# EAGLE design omca (EAGLE 6.2)
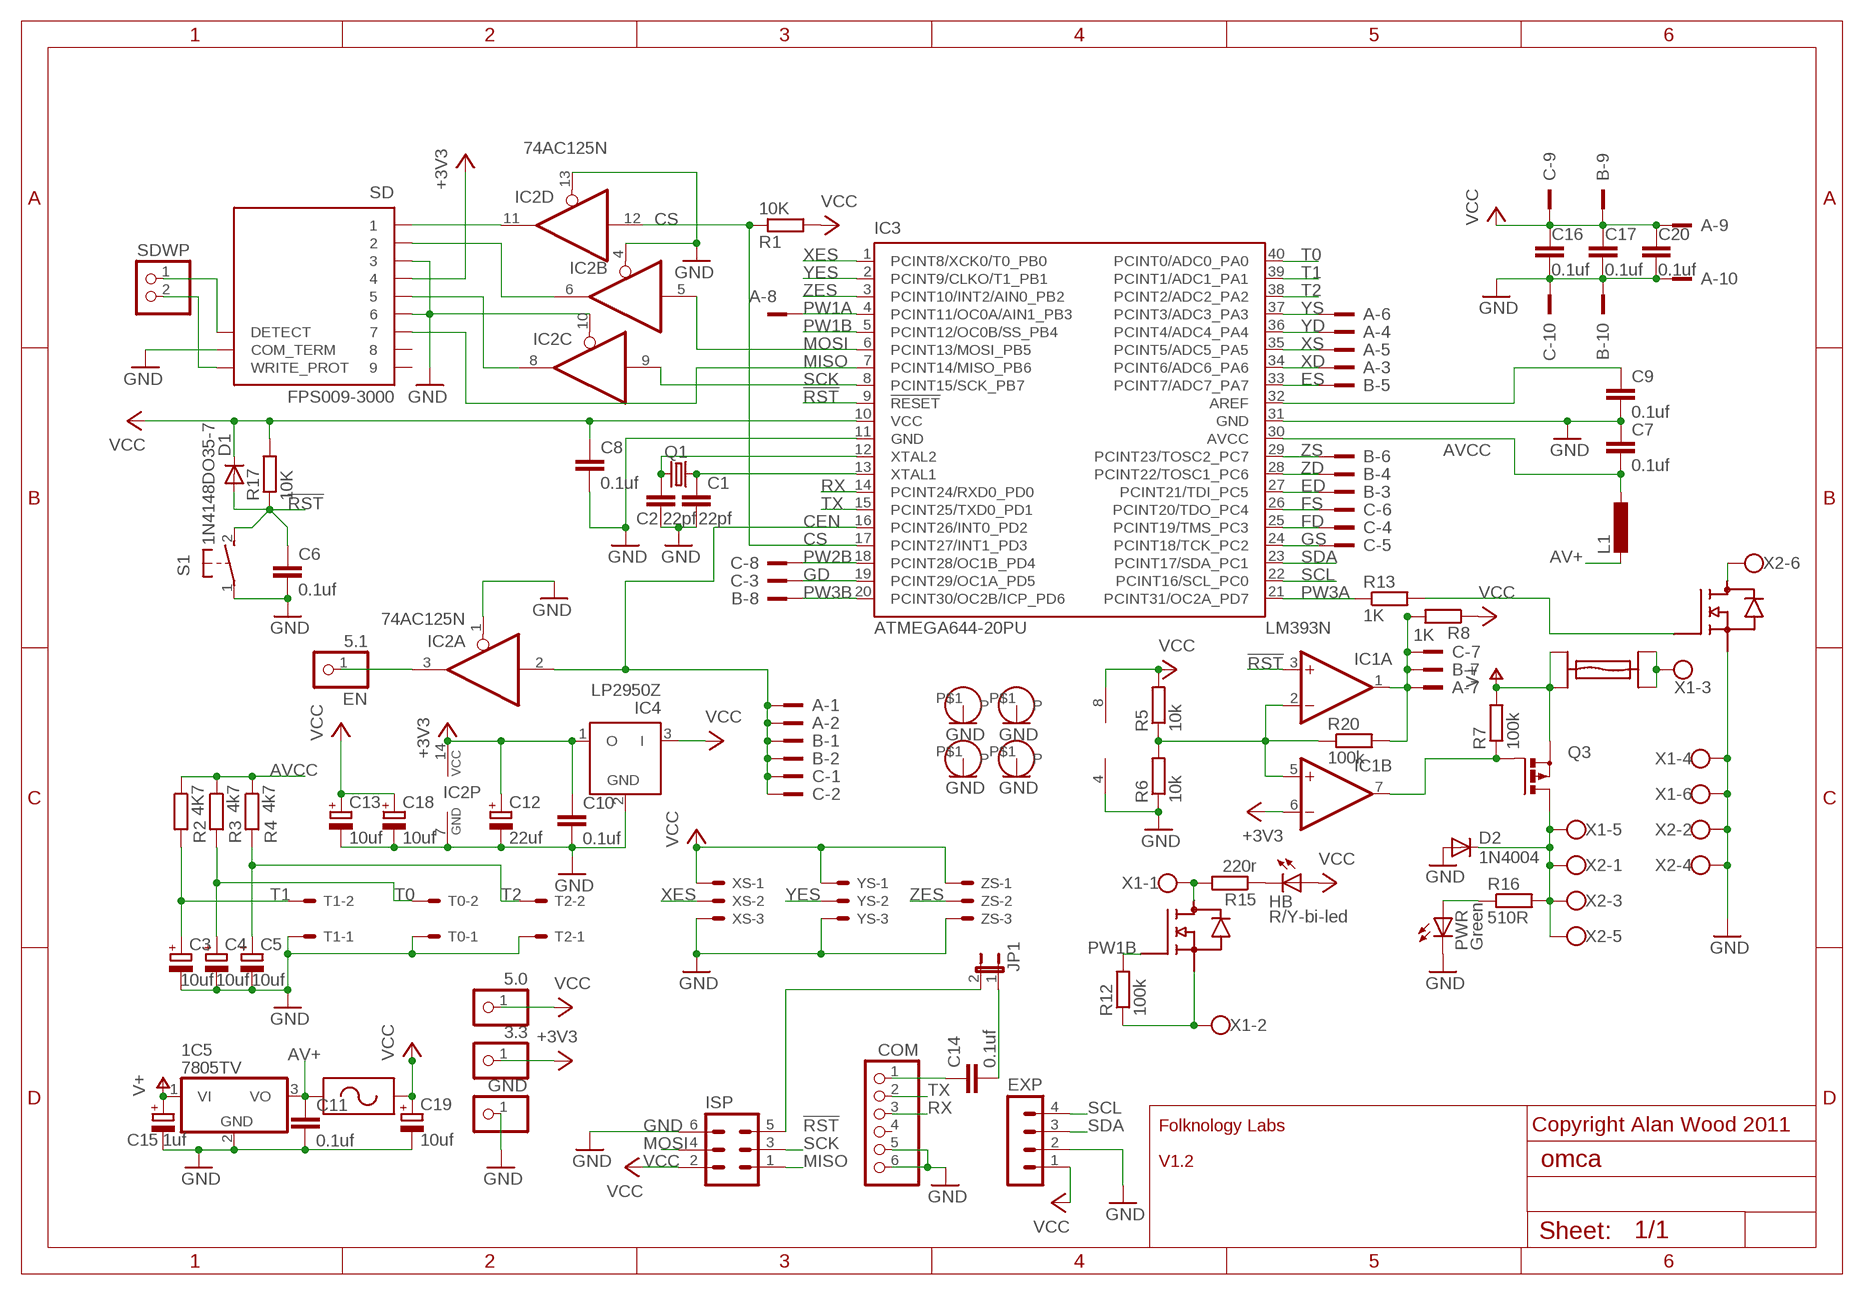
[diagram p0: schematic, sheet 1]

## Parts
1C5  7805TV  [TO220V]
3.3  PINHD-1X1  [1X01]
5.0  PINHD-1X1  [1X01]
5.1  EN  PINHD-1X1  [1X01]
A  2510-5  [PAK100/2500-5-10]
B  2510-5  [PAK100/2500-5-10]
C  2510-5  [PAK100/2500-5-10]
C1  22pf  C-EU025-024X044  [C025-024X044]
C2  22pf  C-EU025-024X044  [C025-024X044]
C3  10uf  CPOL-EUTT2D4  [TT2D4]
C4  10uf  CPOL-EUTT2D4  [TT2D4]
C5  10uf  CPOL-EUTT2D4  [TT2D4]
C6  0.1uf  C-EU025-024X044  [C025-024X044]
C7  0.1uf  C-EU025-024X044  [C025-024X044]
C8  0.1uf  C-EU025-024X044  [C025-024X044]
C9  0.1uf  C-EU025-024X044  [C025-024X044]
C10  0.1uf  C-EU025-024X044  [C025-024X044]
C11  0.1uf  C-EU025-024X044  [C025-024X044]
C12  22uf  CPOL-EUTT2D5  [TT2D5]
C13  10uf  CPOL-EUE2,5-6E  [E2,5-6E]
C14  0.1uf  C-EU025-024X044  [C025-024X044]
C15  1uf  CPOL-EUE2-4  [E2-4]
C16  0.1uf  C-EU025-024X044  [C025-024X044]
C17  0.1uf  C-EU025-024X044  [C025-024X044]
C18  10uf  CPOL-EUE2,5-6E  [E2,5-6E]
C19  10uf  CPOL-EUE2,5-6E  [E2,5-6E]
C20  0.1uf  C-EU025-024X044  [C025-024X044]
COM  PINHD-1X6/90  [1X06/90]
D1  1N4148DO35-7  [DO35-7]
D2  1N4004  [DO41-10]
EXP  MA04-1  [MA04-1]
F1  MINIBLADEFUSEHOLDER  [MINIFUSEHOLDER]
F2  RXEFXXX-RAYCHEM-POLYSWITCH  [2*5.1]
GND  PINHD-1X1  [1X01]
HB  R/Y-bi-led  LED3MM  [LED3MM]
IC1  LM393N  [DIL08]
IC2  74AC125N  [DIL14]
IC3  ATMEGA644-20PU  [DIL40]
IC4  LP2950Z  [TO92]
ISP  ML6  [ML6]
JP1  JP1E  [JP1]
L1  L-EU0207/10  [0207/10]
PWR  Green  LED3MM  [LED3MM]
Q1  CRYSTALHC49S  [HC49/S]
Q2  IPI80N03S4L-04TO262  [TO262]
Q3  PMOSFET_PTO220BV  [TO220BV]
Q4  NTD4963N  [IPAK]
R1  10K  R-EU_0204/7  [0204/7]
R2  4K7  R-EU_0204/7  [0204/7]
R3  4k7  R-EU_0204/7  [0204/7]
R4  4k7  R-EU_0204/7  [0204/7]
R5  10k  R-EU_0204/7  [0204/7]
R6  10k  R-EU_0204/7  [0204/7]
R7  100k  R-EU_0204/7  [0204/7]
R8  1K  R-EU_0204/7  [0204/7]
R12  100k  R-EU_0204/7  [0204/7]
R13  1K  R-EU_0204/7  [0204/7]
R15  220r  R-EU_0204/7  [0204/7]
R16  510R  R-EU_0204/7  [0204/7]
R17  10K  R-EU_0204/7  [0204/7]
R20  100k  R-EU_0204/7  [0204/7]
S1  31-XX  [B3F-31XX]
SD  FPS009-3000  [FPS009-3000]
SDWP  PINHD-1X2  [1X02]
T0  22-05-7028-02  [7395-02]
T1  22-05-7028-02  [7395-02]
T2  22-05-7028-02  [7395-02]
U$2  HOLE  [HOLE]
U$3  HOLE  [HOLE]
U$4  HOLE  [HOLE]
U$5  HOLE  [HOLE]
X1  W237-6  [W237-6]
X2  W237-6  [W237-6]
XS  22-05-7038-03  [7395-03]
YS  22-05-7038-03  [7395-03]
ZS  22-05-7038-03  [7395-03]

## Nets
!RST: C6.1 D1.A IC1.3(A:+IN) IC3.9(!RESET) ISP.5 JP1.2 R17.1 S1.2(S)
!SRST: A.7 B.7 C.7 IC1.1(A:OUT) R8.2 R20.2
+3V3: 3.3.1 C10.1 C12.+ IC1.6(B:-IN) IC2.14(P:VCC) IC4.1(O) SD.4
AV+: 1C5.3(VO) C11.1 F2.P$1 L1.2
AVCC: C7.2 IC3.30(AVCC) L1.1 R2.1 R3.1 R4.1
CEN: A.1 A.2 B.1 B.2 C.1 C.2 IC2.2(A:I) IC3.16(PCINT26/INT0_PD2)
CS: IC2.12(D:I) IC3.17(PCINT27/INT1_PD3) R1.1
ED: B.3 IC3.27(PCINT21/TDI_PC5)
ES: B.5 IC3.33(PCINT7/ADC7_PA7)
FD: C.4 IC3.25(PCINT19/TMS_PC3)
FS: C.6 IC3.26(PCINT20/TDO_PC4)
GD: C.3 IC3.19(PCINT29/OC1A_PD5)
GND: 1C5.2(GND) A.10 B.10 C1.2 C2.2 C3.- C4.- C5.- C6.2 C7.1 C8.2 C9.2 C10.2 C11.2 C12.- C13.- C15.- C16.2 C17.2 C18.- C19.- C20.2 C.10 COM.5 COM.6 D2.A EXP.2 GND.1 IC1.4(P:V-) IC2.1(A:OE) IC2.4(B:OE) IC2.7(P:GND) IC2.10(C:OE) IC2.13(D:OE) IC3.11(GND) IC3.31(GND) IC4.2(GND) ISP.6 PWR.K(C) Q4.P$3(S) R6.1 S1.1(P) SD.3 SD.6 SD.COM_TERM T0.1 T1.1 T2.1 U$2.P$1(P) U$3.P$1(P) U$4.P$1(P) U$5.P$1(P) X1.4 X1.6 X2.2 X2.4 XS.3 YS.3 ZS.3
GS: C.5 IC3.24(PCINT18/TCK_PC2)
MISO: IC3.7(PCINT14/MISO_PB6) ISP.1 SD.7
MOSI: IC2.5(B:I) IC3.6(PCINT13/MOSI_PB5) ISP.4
N$1: IC2.11(D:O) SD.1
N$2: IC2.6(B:O) SD.2
N$3: IC2.8(C:O) SD.5
N$4: HB.K(C) R15.1
N$5: C14.1 COM.1
N$6: SD.WRITE_PROT SDWP.2
N$7: 5.1.1 IC2.3(A:O)
N$9: Q2.2(D) R15.2 X1.1
N$10: Q2.3(S) R12.1 X1.2
N$11: Q4.P$2(D) X2.6
N$12: IC1.2(A:-IN) IC1.5(B:+IN) R5.1 R6.2 R20.1
N$13: SD.DETECT SDWP.1
N$14: IC1.7(B:OUT) Q3.G R7.1
N$15: Q4.P$1(G) R13.2
N$16: D2.C Q3.D R16.2 X1.5 X2.1 X2.3 X2.5
N$17: PWR.A R16.1
N$23: F1.P$1(F1A) F1.P$2(F1B) X1.3
N$32: C14.2 JP1.1
N$37: C2.1 IC3.12(XTAL2) Q1.2
N$38: C1.1 IC3.13(XTAL1) Q1.1
N$47: C9.1 IC3.32(AREF)
PW1A: A.8 IC3.4(PCINT11/OC0A/AIN1_PB3)
PW1B: IC3.5(PCINT12/OC0B/SS_PB4) Q2.1(G) R12.2
PW2B: C.8 IC3.18(PCINT28/OC1B_PD4)
PW3A: IC3.21(PCINT31/OC2A_PD7) R13.1
PW3B: B.8 IC3.20(PCINT30/OC2B/ICP_PD6)
RX: COM.3 IC3.14(PCINT24/RXD0_PD0)
SCK: IC2.9(C:I) IC3.8(PCINT15/SCK_PB7) ISP.3
SCL: EXP.4 IC3.22(PCINT16/SCL_PC0)
SDA: EXP.3 IC3.23(PCINT17/SDA_PC1)
T0: C4.+ IC3.40(PCINT0/ADC0_PA0) R3.2 T0.2
T1: C3.+ IC3.39(PCINT1/ADC1_PA1) R2.2 T1.2
T2: C5.+ IC3.38(PCINT2/ADC2_PA2) R4.2 T2.2
TX: COM.2 IC3.15(PCINT25/TXD0_PD1)
V+: 1C5.1(VI) C15.+ F1.P$3(F2A) F1.P$4(F2B) Q3.S R7.2
VCC: 5.0.1 A.9 B.9 C8.1 C13.+ C16.1 C17.1 C18.+ C19.+ C20.1 C.9 D1.C EXP.1 F2.P$2 HB.A IC1.8(P:V+) IC3.10(VCC) IC4.3(I) ISP.2 R1.2 R5.2 R8.1 R17.2 XS.1 YS.1 ZS.1
XD: A.3 IC3.34(PCINT6/ADC6_PA6)
XES: IC3.1(PCINT8/XCK0/T0_PB0) XS.2
XS: A.5 IC3.35(PCINT5/ADC5_PA5)
YD: A.4 IC3.36(PCINT4/ADC4_PA4)
YES: IC3.2(PCINT9/CLKO/T1_PB1) YS.2
YS: A.6 IC3.37(PCINT3/ADC3_PA3)
ZD: B.4 IC3.28(PCINT22/TOSC1_PC6)
ZES: IC3.3(PCINT10/INT2/AIN0_PB2) ZS.2
ZS: B.6 IC3.29(PCINT23/TOSC2_PC7)
Unconnected: COM.4 SD.8 SD.9

## Notes on the sheet
- Folknology Labs | Copyright Alan Wood 2011
- V1.2

## Library data of the parts
1C5 = linear:78*: Positive VOLTAGE REGULATOR Source: http://cache.national.com/ds/LM/LM78L05.pdf http://www.fairchildsemi.com/ds/LM/LM7805.pdf; MF: STMICROELECTRONICS; MPN: L7805CV; OC_FARNELL: 9756078
3.3 5.0 5.1 GND = pinhead:PINHD-1X1: PIN HEADER; MF: MULTICOMP; MPN: 2211S-02G; OC_FARNELL: 1593411
A B C = con-3m:2510-: 3M (TM) Pak 100 4-Wall Header Source: 3M; MF: HARTING; MPN: 09 18 510 7323; OC_FARNELL: 1096980; OC_NEWARK: unknown
C1 C2 = rcl:C-EU: CAPACITOR, European symbol; MF: AVX; MPN: SR151A220JAR; OC_FARNELL: 1100369
C3-C5 C12 C15 C18 C19 = rcl:CPOL-EU: POLARIZED CAPACITOR, European symbol; MF: RUBYCON; MPN: 100YXF10MEFC6.3X11; OC_FARNELL: 1144640
C6-C11 C14 C16 C17 C20 = rcl:C-EU: CAPACITOR, European symbol; MF: VISHAY; MPN: K104K15X7RF53L2; OC_FARNELL: 1141775
C13 = rcl:CPOL-EU: POLARIZED CAPACITOR, European symbol; MF: RUBYCON; MPN: 25ZL47MEFC5X11; OC_FARNELL: 1144696
COM = pinhead:PINHD-1X6: PIN HEADER; MF: MULTICOMP; MPN: MC34751; OC_FARNELL: 1593430
D1 = diode:1N4148: DIODE high speed (Philips); MF: VISHAY SEMICONDUCTOR; MPN: 1N4148-TR; OC_FARNELL: 1469384
D2 = diode:1N4004: DIODE general purpose rectifier, 1 A
EXP = con-lstb:MA04-1: PIN HEADER; MF: TE CONNECTIVITY / AMP; MPN: 826926-4; OC_FARNELL: 1248142; OC_NEWARK: unknown
F1 = gen:MINIBLADEFUSEHOLDER
F2 = gen:RXEFXXX-RAYCHEM-POLYSWITCH
HB PWR = led:LED: LED OSRAM: - CHIPLED LG R971, LG N971, LY N971, LG Q971, LY Q971, LO R971, LY R971 LH N974, LH R974 LS Q976, LO Q976, LY Q976 LO Q996 - Hyper CHIPLED LW Q18S LB Q993, LB Q99A, LB R99A - SideLED LS A670, LO A670, LY A670, LG A670, LP A670 LB A673, LV A673, LT A673, LW A673 LH A674 LY A675 LS A676, LA A676, LO A676, LY A676, LW A676 LS A679, LY A679, LG A679 - Hyper Micro SIDELED® LS Y876, LA Y876, LO Y876, LY Y876 LT Y87S - SmartLED LW L88C, LW L88S LB L89C, LB L89S, LG L890 LS L89K, LO L89K, LY L89K LS L896, LA L896, LO L896, LY L896 - TOPLED LS T670, LO T670, LY T670, LG T670, LP T670 LSG T670, LSP T670, LSY T670, LOP T670, LYG T670 LG T671, LOG T671, LSG T671 LB T673, LV T673, LT T673, LW T673 LH T674 LS T676, LA T676, LO T676, LY T676, LB T676, LH T676, LSB T676, LW T676 LB T67C, LV T67C, LT T67C, LS T67K, LO T67K, LY T67K, LW E67C LS E67B, LA E67B, LO E67B, LY E67B, LB E67C, LV E67C, LT E67C LW T67C LS T679, LY T679, LG T679 LS T770, LO T770, LY T770, LG T770, LP T770 LB T773, LV T773, LT T773, LW T773 LH T774 LS E675, LA E675, LY E675, LS T675 LS T776, LA T776, LO T776, LY T776, LB T776 LHGB T686 LT T68C, LB T68C - Hyper Mini TOPLED® LB M676 - Mini TOPLED Santana® LG M470 LS M47K, LO M47K, LY M47K Source: http://www.osram.convergy.de LUXEON: - LUMILED® LXK2-PW12-R00, LXK2-PW12-S00, LXK2-PW14-U00, LXK2-PW14-V00 LXK2-PM12-R00, LXK2-PM12-S00, LXK2-PM14-U00 LXK2-PE12-Q00, LXK2-PE12-R00, LXK2-PE12-S00, LXK2-PE14-T00, LXK2-PE14-U00 LXK2-PB12-K00, LXK2-PB12-L00, LXK2-PB12-M00, LXK2-PB14-N00, LXK2-PB14-P00, LXK2-PB14-Q00 LXK2-PR12-L00, LXK2-PR12-M00, LXK2-PR14-Q00, LXK2-PR14-R00 LXK2-PD12-Q00, LXK2-PD12-R00, LXK2-PD12-S00 LXK2-PH12-R00, LXK2-PH12-S00 LXK2-PL12-P00, LXK2-PL12-Q00, LXK2-PL12-R00 Source: www.luxeon.com KINGBRIGHT: KA-3528ASYC Source: www.kingbright.com
IC1 = linear:LM393: COMPARATOR; MF: ON SEMICONDUCTOR; MPN: LM393NG; OC_FARNELL: 1211133
IC2 = 74xx-eu:74*125: Quad bus BUFFER, 3-state; MF: TEXAS INSTRUMENTS; MPN: SN74AHC125N; OC_FARNELL: 1749617
IC3 = atmel:ATMEGA644-*PU: 8-bit Microcontroller with 64K Bytes In-System Programmable Flash Auto generated by make-symbol-device-package-bsdl.ulp Rev. 34 Source: http://www.atmel.com/dyn/resources/prod_documents/doc2593.pdf; MF: ATMEL; MPN: ATMEGA644-20PU; OC_FARNELL: 1288340; OC_NEWARK: 23M5060
IC4 = linear:LP2950: 100 mA, Low Power Low Dropout Voltage Regulator Source: http://www.onsemi.com/pub/Collateral/LP2950-D.PDF; MF: NATIONAL SEMICONDUCTOR; MPN: LP2950CZ-3.3/NOPB; OC_FARNELL: 1469118
ISP = con-harting-ml:ML6: HARTING; MF: HARTING; MPN: 09 18 506 7324; OC_FARNELL: 1096984; OC_NEWARK: unknown
JP1 = jumper:JP1E: JUMPER; MF: MULTICOMP; MPN: 2211S-02G; OC_FARNELL: 1593411
L1 = rcl:L-EU: INDUCTOR, European symbol; MF: MULTICOMP; MPN: MCAL0410A1-101KU; OC_FARNELL: 1864497
Q1 = crystal:CRYSTAL: CRYSTAL; MF: MULTICOMP; MPN: HC49SM-3.6864-30-50-60-16-ATF; OC_FARNELL: 1667008; OC_NEWARK: unknown
Q2 = amino:IPI80N03S4L-04
Q3 = transistor-power:PMOSFET_P: Power MOSFET P-Channel; MF: VISHAY; MPN: SUP75P03-07-E3; OC_FARNELL: 1794812
Q4 = amino:NTD4963N
R1 R5 R6 R17 = rcl:R-EU_: RESISTOR, European symbol; MF: WELWYN; MPN: MFR4 10K 1%; OC_FARNELL: 1099988
R2-R4 = rcl:R-EU_: RESISTOR, European symbol; MF: WELWYN; MPN: MFR4 4K7 1%; OC_FARNELL: 1099979
R7 R12 R20 = rcl:R-EU_: RESISTOR, European symbol; MF: WELWYN; MPN: MFR4 100K 1%; OC_FARNELL: 1100015
R8 R13 = rcl:R-EU_: RESISTOR, European symbol; MF: WELWYN; MPN: MFR4 1K 1%; OC_FARNELL: 1099893
R15 R16 = rcl:R-EU_: RESISTOR, European symbol; MF: WELWYN; MPN: MFR4 470R 1%; OC_FARNELL: 1099883
S1 = switch-omron:31-XX: OMRON SWITCH; MPN: B3F-3100; OC_FARNELL: 959704; OC_NEWARK: 36M3582
SD = con-yamaichi:FPS009-300*: SD Card and MMC Reader (Manual Insertion) Source: http://www.yamaichi.de/pdf/c_fps009_3000.pdf; MF: MULTICOMP; MPN: SDAMB-01215BT00; OC_FARNELL: 9186140; OC_NEWARK: unknown
SDWP = pinhead:PINHD-1X2: PIN HEADER; MF: MULTICOMP; MPN: 2211S-02G; OC_FARNELL: 1593411
T0 T1 T2 = con-molex:22-?-02: CONNECTOR wire to board 2.54 mm (.1 inch) pitch header; MF: MOLEX; MPN: 22-05-7028; OC_FARNELL: 9731601; OC_NEWARK: unknown
U$2-U$5 = amino:HOLE; OC_FARNELL: unknown
X1 X2 = con-wago-500:W237-6: WAGO SCREW CLAMP; OC_FARNELL: unknown; OC_NEWARK: unknown
XS YS ZS = con-molex:22-?-03: CONNECTOR wire to board 2.54 mm (.1 inch) pitch header; MF: MOLEX; MPN: 22-05-7038; OC_FARNELL: 9731610; OC_NEWARK: unknown

## Board
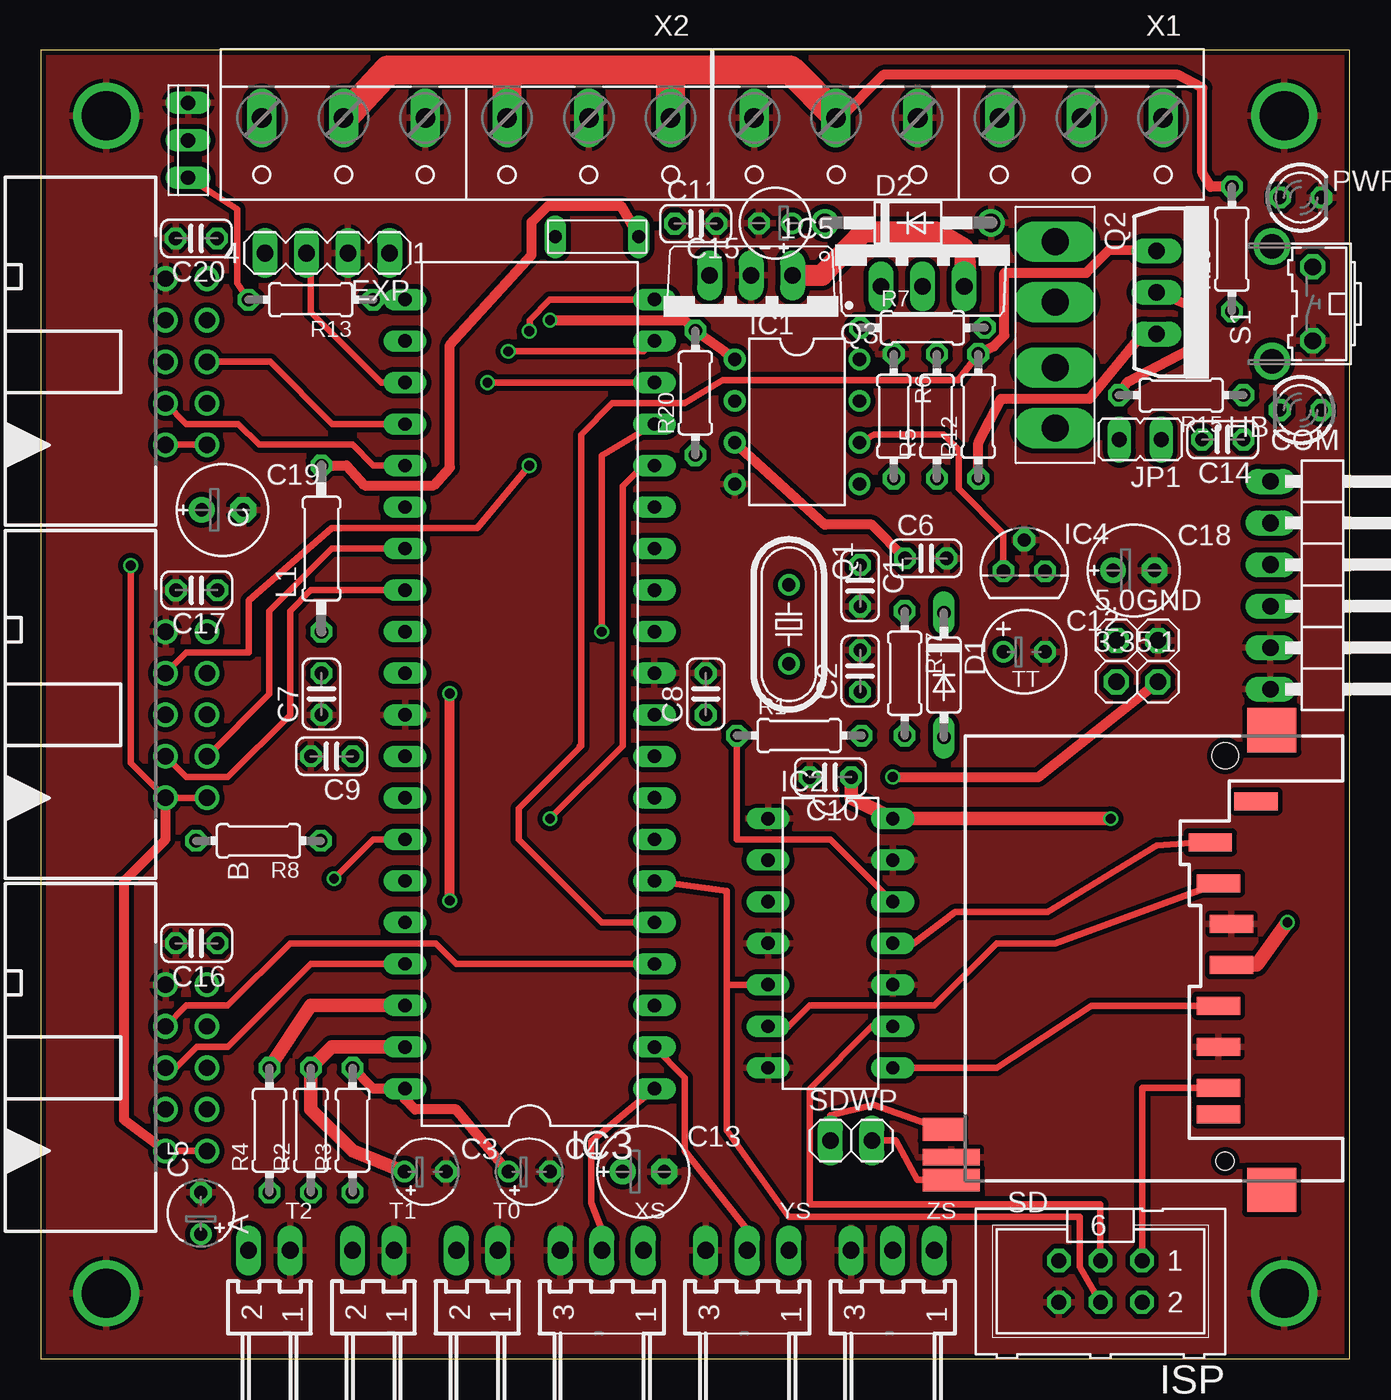
[diagram p1: board, top side]
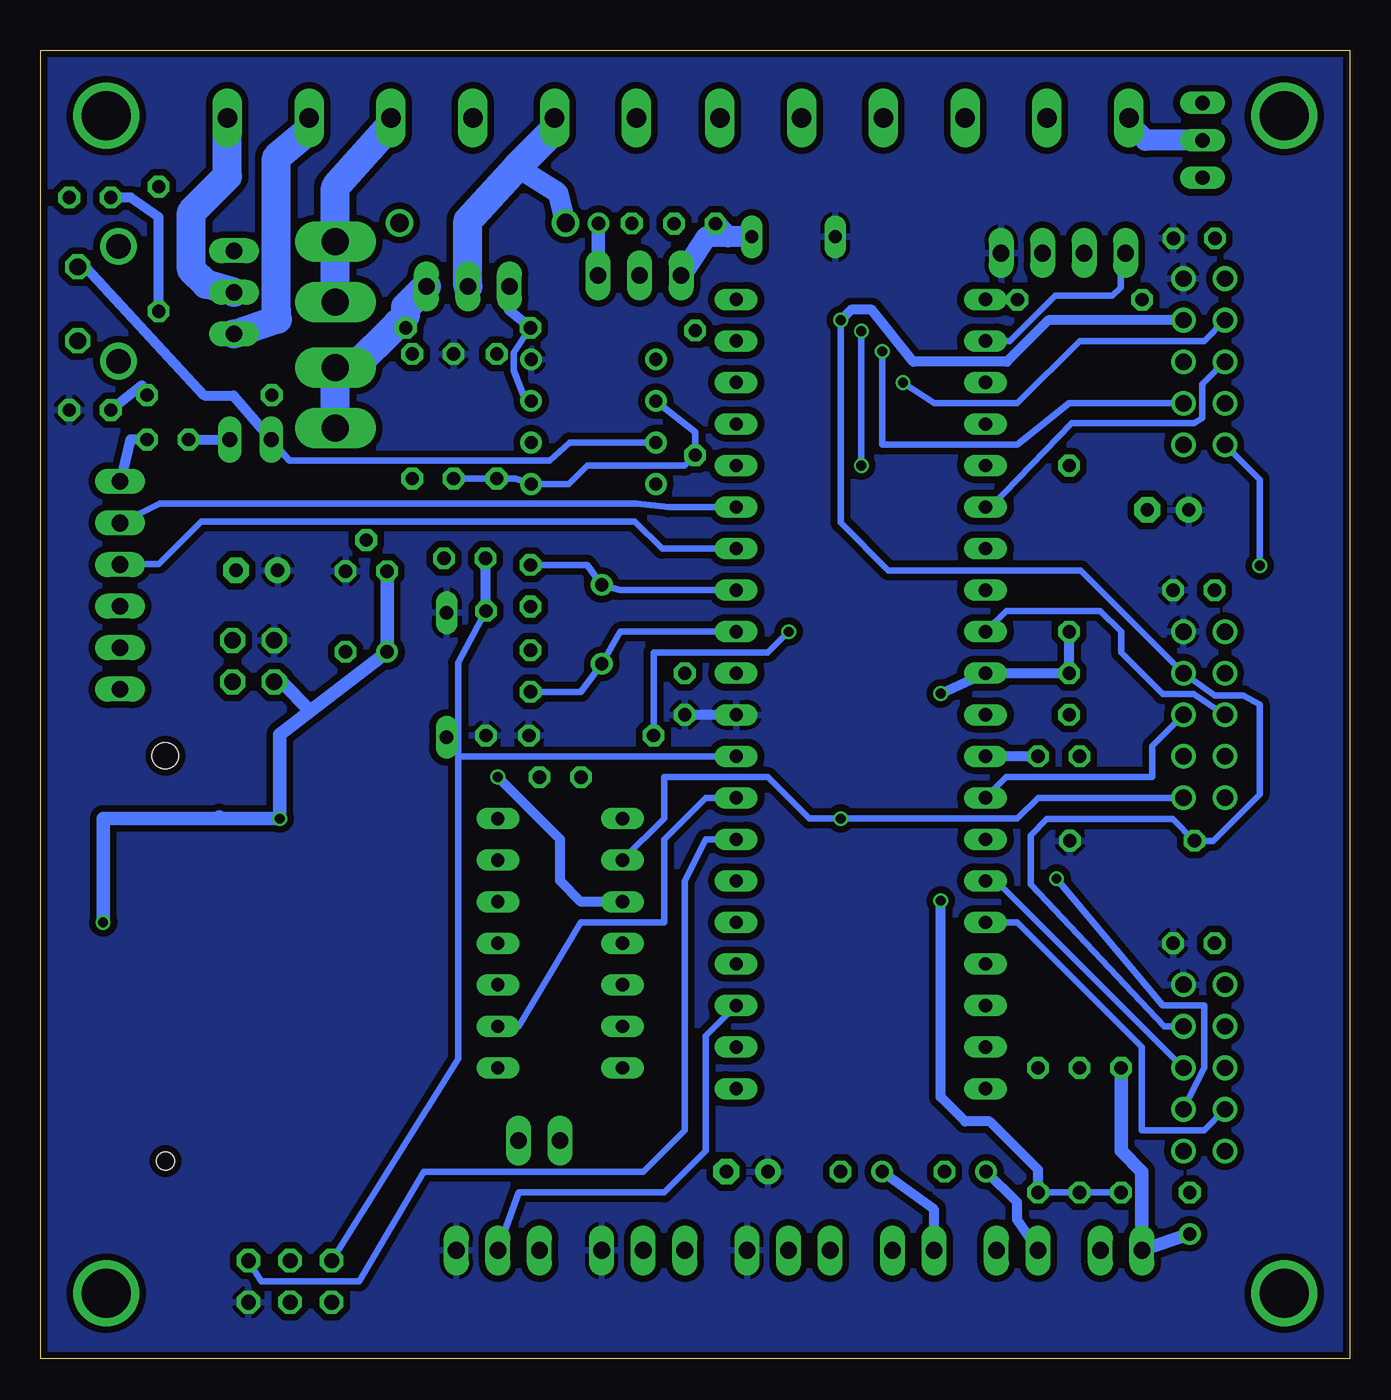
[diagram p2: board, bottom side, seen from below]

Size 80 x 80 mm. Coordinates in mm from the lower left corner, seen from the top.
Outline: 0,0 80,0 80,80 0,80 0,0
Copper layers (1*16): Top 0.035mm / dielectric 1.5mm / Bottom 0.035mm
Design rules: minimum track width 6mil, minimum drill 12mil, track to track 6mil, track to pad 6mil, pad to pad 6mil, via to via 6mil, smd to smd 0mil, copper to edge 10mil, drill to drill 10mil, minimum pad ring 10mil, minimum via ring 6mil, stop-mask expansion 2mil, vias tented up to drill 100mil, thermal gap 10mil

### Footprints (pad centres in the part's own frame; a part is rotated, then mirrored left to right if it is on the bottom)
TO220V = drill 1.016 long: 1 -2.54,-2.54; 2 0,-2.54; 3 2.54,-2.54
1X01 = drill 1.016 octagon: 1 0,0
PAK100/2500-5-10 = drill 1 pad 1.422: 1 -5.08,-1.27; 2 -5.08,1.27; 3 -2.54,-1.27; 4 -2.54,1.27; 5 0,-1.27; 6 0,1.27; 7 2.54,-1.27; 8 2.54,1.27; 9 5.08,-1.27; 10 5.08,1.27
C025-024X044 = drill 0.813 octagon: 1 -1.27,0; 2 1.27,0
TT2D4 = drill 0.813: + -1.27,0 | drill 0.813 octagon: - 1.27,0
TT2D5 = drill 0.813: + -1.27,0 | drill 0.813 octagon: - 1.27,0
E2,5-6E = drill 0.813 pad 1.575: + -1.27,0 | drill 0.813 pad 1.575 octagon: - 1.27,0
E2-4 = drill 0.813 pad 1.27: + -1.016,0 | drill 0.813 pad 1.27 octagon: - 1.016,0
1X06/90 = drill 1.016 long: 1 -6.35,-3.81; 2 -3.81,-3.81; 3 -1.27,-3.81; 4 1.27,-3.81; 5 3.81,-3.81; 6 6.35,-3.81
DO35-7 = drill 0.813 long: A 3.81,0; C -3.81,0
DO41-10 = drill 1.118: A 5.08,0; C -5.08,0
MA04-1 = drill 1.016 long: 1 -3.81,0; 2 -1.27,0; 3 1.27,0; 4 3.81,0
MINIFUSEHOLDER = drill 1.65 long: P$1 -5.7,0; P$2 -2,0; P$3 2,0; P$4 5.7,0
2*5.1 = drill 0.8 long: P$1 -2.55,0; P$2 2.55,0
LED3MM = drill 0.813 octagon: A -1.27,0; K 1.27,0
DIL08 = drill 0.813 pad 1.27: 1 -3.81,-3.81; 2 -1.27,-3.81; 3 1.27,-3.81; 4 3.81,-3.81; 5 3.81,3.81; 6 1.27,3.81; 7 -1.27,3.81; 8 -3.81,3.81
DIL14 = drill 0.813 long: 1 -7.62,-3.81; 2 -5.08,-3.81; 3 -2.54,-3.81; 4 0,-3.81; 5 2.54,-3.81; 6 5.08,-3.81; 7 7.62,-3.81; 8 7.62,3.81; 9 5.08,3.81; 10 2.54,3.81; 11 0,3.81; 12 -2.54,3.81; 13 -5.08,3.81; 14 -7.62,3.81
DIL40 = drill 0.813 long: 1 -24.13,-7.62; 2 -21.59,-7.62; 3 -19.05,-7.62; 4 -16.51,-7.62; 5 -13.97,-7.62; 6 -11.43,-7.62; 7 -8.89,-7.62; 8 -6.35,-7.62; 9 -3.81,-7.62; 10 -1.27,-7.62; 11 1.27,-7.62; 12 3.81,-7.62; 13 6.35,-7.62; 14 8.89,-7.62; 15 11.43,-7.62; 16 13.97,-7.62; 17 16.51,-7.62; 18 19.05,-7.62; 19 21.59,-7.62; 20 24.13,-7.62; 21 24.13,7.62; 22 21.59,7.62; 23 19.05,7.62; 24 16.51,7.62; 25 13.97,7.62; 26 11.43,7.62; 27 8.89,7.62; 28 6.35,7.62; 29 3.81,7.62; 30 1.27,7.62; 31 -1.27,7.62; 32 -3.81,7.62; 33 -6.35,7.62; 34 -8.89,7.62; 35 -11.43,7.62; 36 -13.97,7.62; 37 -16.51,7.62; 38 -19.05,7.62; 39 -21.59,7.62; 40 -24.13,7.62
TO92 = drill 0.813 octagon: 1 -1.27,0; 2 0,1.905; 3 1.27,0
ML6 = drill 0.914 octagon: 1 -2.54,-1.27; 2 -2.54,1.27; 3 0,-1.27; 4 0,1.27; 5 2.54,-1.27; 6 2.54,1.27
JP1 = drill 0.914 long: 1 0,-1.27; 2 0,1.27
0207/10 = drill 0.813 octagon: 1 -5.08,0; 2 5.08,0
HC49/S = drill 0.813: 1 -2.413,0; 2 2.413,0
TO262 = drill 1.016 long: 1 -2.54,0; 2 0,0; 3 2.54,0
TO220BV = drill 1.016 long: D 0,-2.54; G -2.54,-2.54; S 2.54,-2.54
IPAK = drill 0.88 pad 1.27 long: P$1 -2.29,0; P$2 0,0; P$3 2.29,0
0204/7 = drill 0.813 octagon: 1 -3.81,0; 2 3.81,0
B3F-31XX = drill 1.016 octagon: 1 -2.261,-1.245; 2 2.261,-1.245 | drill 1.499 pad 2.159: 3 -3.505,1.245; 4 3.505,1.245
FPS009-3000 = smd 2.65 x 1.1: 1 -0.915,-5.3; 2 -0.415,-7.8; 3 0.385,-10.3; 4 0.385,-12.8; 5 -0.415,-15.3; 6 -0.415,-17.8; 7 -0.415,-20.3; 8 -0.415,-21.925; 9 1.885,-2.8 | smd 3.5 x 1: COM_TERM -16.75,-24.55 | smd 2.5 x 1.4: DETECT -17.25,-22.85 | smd 3 x 2.7: M1 2.85,1.55; M2 2.85,-26.55 | smd 3.5 x 1.4: WRITE_PROT -16.75,-25.95 | hole 1.6: 0,0 | hole 1.1: 0,-24.8
1X02 = drill 1.016 long: 1 -1.27,0; 2 1.27,0
7395-02 = drill 1.016 long: 1 1.27,0; 2 -1.27,0
HOLE = drill 3: P$1 0,0
W237-6 = drill 1.194 long: 1 -12.5,-1.27; 2 -7.5,-1.27; 3 -2.5,-1.27; 4 2.5,-1.27; 5 7.5,-1.27; 6 12.5,-1.27
7395-03 = drill 1.016 long: 1 2.54,0; 2 0,0; 3 -2.54,0

### Placement (x,y rotation side)
1C5  43.41,63.7 180 top
3.3  65.74,41.38 0 top
5.0  65.74,43.92 0 top
5.1  68.28,41.38 0 top
A  8.89,17.78 90 top
B  8.89,39.37 90 top
C  8.89,60.96 90 top
C1  50.08,47.26 270 top
C2  50.08,42.05 90 top
C3  23.5,11.43 0 top
C4  29.84,11.43 0 top
C5  9.78,8.89 90 top
C6  54.09,48.94 0 top
C7  17.14,40.64 90 top
C8  40.64,40.64 90 top
C9  17.78,36.83 180 top
C10  48.26,35.56 180 top
C11  40.02,69.4 0 top
C12  60.11,43.22 0 top
C13  36.83,11.43 0 top
C14  72.25,56.2 180 top
C15  44.9,69.42 180 top
C16  9.53,25.4 180 top
C17  9.53,46.99 180 top
C18  66.8,48.2 0 top
C19  11.1,51.9 0 top
C20  9.5,68.5 180 top
COM  78.97,47.28 270 top
D1  55.2,41.8 270 top
D2  53,69.45 0 top
EXP  17.5,67.6 180 top
F1  62,62.6 270 top
F2  34,68.6 180 top
GND  68.28,43.92 0 top
HB  77,58 180 top
IC1  46.22,57.28 270 top
IC2  48.26,25.4 270 top
IC3  29.88,40.64 90 top
IC4  60.11,48.15 0 top
ISP  64.77,4.72 180 top
JP1  67.2,56.2 90 top
L1  17.14,49.53 90 top
PWR  77,71 0 top
Q1  45.72,44.9 270 top
Q2  68.2,65.2 270 top
Q3  53.9,68.11 0 top
Q4  9,74.5 90 top
R1  46.35,38.1 0 top
R2  16.51,13.97 90 top
R3  19.05,13.97 90 top
R4  13.97,13.97 90 top
R5  54.77,57.62 90 top
R6  52.13,57.62 270 top
R7  53.88,63.03 0 top
R8  13.29,31.66 180 top
R12  57.3,57.62 90 top
R13  16.5,64.75 180 top
R15  69.7,58.91 180 top
R16  72.8,67.85 90 top
R17  52.8,41.91 270 top
R20  40.01,59.05 90 top
S1  76.5,64.5 90 top
SD  72.39,36.87 0 top
SDWP  49.53,13.34 0 top
T0  26.67,6.62 0 top
T1  20.32,6.62 0 top
T2  13.97,6.62 0 top
U$2  4,4 0 top
U$3  4,76 0 top
U$4  76,76 0 top
U$5  76,4 0 top
X1  56.1,74.6 180 top
X2  26,74.6 180 top
XS  34.29,6.62 0 top
YS  43.18,6.62 0 top
ZS  52.07,6.62 0 top

### Tracks (layer width: path | path; a pad name or v marks a point on that pad's centre or on a via)
!RST
  Top 0.61: C6.1 50.8,51 47.92,51 IC1.3
  Bottom 0.406: 54.5,36.83 54.5,18.33 ISP.5 | 54.5,36.83 IC3.9 | R17.1 54.5,42.56 54.5,38 | 54.5,38 54.5,36.83 | D1.A 54.51,37.99 54.5,38 | JP1.2 64.83,54.9 48.9,54.9 47.69,56.02 IC1.3
  Bottom 0.61: C6.1 52.83,47.01 R17.1 | S1.2 77.25,66.75 70,58.9 68.23,58.9 JP1.2
!SRST  (via drill 0.6)
  Top 0.61: v31.11,63.5 39.37,63.5 R20.2 41.77,61.59 IC1.1
  Bottom 0.406: v31.11,63.5 31.11,51.12 28.2,48.2 16.45,48.2 B.7 8.25,40.55 6.5,40.55 5.5,40 5.5,34.5 8.34,31.66 R8.2 10.82,33 18.5,33 19.5,32 19.5,29 11.32,20.32 A.7
  Bottom 0.61: C.7 18.41,63.5 20.95,60.96 26.67,60.96 29.21,64.14 30.48,64.14 v31.11,63.5
+3V3  (via drill 0.6)
  Top 0.406: IC4.1 58.84,50.46 56.1,53.2 56.1,55.6 55.2,56.5 50.95,56.5 IC1.6
  Top 0.813: SD.4 74.33,24.07 v76.2,26.67 | v65.41,33.02 IC2.14 49.53,34.29 C10.1
  Bottom 0.813: v76.2,26.67 76.2,33.02 69,33.02 | 69,33.02 v65.41,33.02 65.41,38.16 63.52,39.61 | 69.11,33.13 69,33.02 | 63.52,39.61 C12.+ IC4.1 | 3.3.1 65.29,41.38 63.52,39.61
AV+
  Top 0.61: L1.2 18.69,54.61 19.8,53.4 24,53.4 25,54.5 25,62 30,67.5 30,69.5 31,70.5 35.45,70.5 F2.P$1
  Bottom 1.27: F2.P$1 38,68.6 | 38,68.6 39.31,68.6 1C5.3 | C11.1 38.26,68.86 38,68.6
AVCC  (via drill 0.6)
  Top 0.61: v25,28 v25,40.67
  Bottom 0.406: R4.1 R2.1 R3.1
  Bottom 0.61: L1.1 C7.2 IC3.30 v25,40.67 | R3.1 19.05,11.55 22,14.5 23.5,14.5 25,16 v25,28
CEN  (via drill 0.6)
  Top 0.406: v31.11,33.02 35.56,37.47 35.56,53.34 36.83,54.61 IC3.16 | A.2 A.1 | B.1 B.2 5.5,36.41 v5.5,48.5 | C.2 C.1
  Top 0.61: A.2 5.08,14.61 5.08,29.21 7.62,31.75 B.2
  Bottom 0.406: B.1 19.05,34.29 20.32,33.02 v31.11,33.02 33.02,33.02 35.56,35.56 41.91,35.56 41.91,33.02 IC2.2 | v5.5,48.5 5.5,53.76 C.2
CS  (via drill 0.6)
  Top 0.406: IC3.17 34.29,55.21 v34.29,44.45 | IC2.12 48.26,31.75 42.55,31.75 R1.1
  Bottom 0.406: v34.29,44.45 35.56,43.18 42.55,43.18 R1.1
ED
  Top 0.406: IC3.27 17.78,49.53 13.97,45.72 13.97,40.64 B.3
ES
  Bottom 0.406: IC3.33 20.99,35.56 12.06,35.56 12.06,37.47 B.5
FD
  Top 0.406: C.4 8.89,57.15 12.06,57.15 13.34,55.88 19.05,55.88 20.32,54.61 IC3.25
FS
  Bottom 0.406: C.6 9,59.58 9,57.5 9.5,57.2 17,57.2 21.93,52.07 IC3.26
GD  (via drill 0.6)
  Top 0.406: IC3.19 36.87,61.59 v28.57,61.59
  Bottom 0.406: v28.57,61.59 28.57,55.88 20.32,55.88 17.14,58.42 C.3
GND
  pour Top (isolate 0.305): 0,80 80,80 80,0 0,0
GS
  Top 0.406: C.5 14.01,60.96 17.82,57.15 IC3.24
MISO
  Top 0.406: ISP.1 67.33,16.57 SD.7
  Bottom 0.406: ISP.1 66.54,4.72 60.55,4.72 56.61,11.43 43.18,11.43 40.64,13.97 40.64,29.21 39.37,31.75 IC3.7
MOSI
  Top 0.406: ISP.4 63.5,5.62 63.5,8.66 45.72,8.66 41.91,13.97 41.91,22.86 | 41.91,22.86 IC2.5 | IC3.6 41.91,28.61 41.91,22.86
N$1
  Top 0.406: SD.1 70.72,31.57 68.22,31.39 61.53,27.3 55.88,27.3 53.34,25.4 IC2.11
N$2
  Top 0.406: SD.2 61.99,25.4 58.42,25.4 54.61,21.59 46.99,21.59 45.72,20.32 IC2.6
N$3
  Top 0.406: IC2.8 58.42,17.78 64.21,21.57 SD.5
N$4
  Bottom 0.61: R15.1 73.83,59.5 HB.K
N$5
  Bottom 0.61: C14.1 74.53,56.2 COM.1
N$6
  Top 0.406: SD.WRITE_PROT 53.55,10.92 52.24,13.34 SDWP.2
N$7  (via drill 0.6)
  Top 0.61: v52.07,35.56 60.96,35.56 5.1.1
  Bottom 0.61: v52.07,35.56 48.26,31.75 48.26,29.21 46.99,27.94 IC2.3
N$9
  Top 0.61: R15.2 66.42,59.72 70.2,61.7 70.2,64.4 Q2.2
  Bottom 1.778: Q2.2 69.9,65.7 70.8,66.6 70.8,70.1 68.6,72.3 X1.1
N$10
  Top 0.61: R12.1 57.3,56 58.7,58.7 64.1,58.7 67.3,62.6 Q2.3
  Bottom 1.778: Q2.3 65.54,63.56 65.6,64.1 65.6,73.43 63.6,75.13 X1.2
N$11
  Bottom 1.27: Q4.P$2 12.47,74.5 13.5,75.53 X2.6
N$12
  Bottom 0.406: R5.1 R6.2 50.99,53.81 IC1.5 47.73,53.48 46.6,54.6 40.65,54.6 R20.1 40.01,56.65 IC1.2
N$13
  Top 0.406: SD.DETECT 50.91,15.52 48.26,14.88 SDWP.1
N$14
  Bottom 0.406: IC1.7 50.35,58.55 51.1,60.4 51.1,61.51 R7.1
  Bottom 0.61: R7.1 51.4,64.1 Q3.G
N$15
  Top 0.406: Q4.P$1 12,70.29 12,65.75 R13.2
N$16
  Top 0.61: R16.2 71.5,71.66 71,72.5 71,77.7 69.5,78.5 51.49,78.5 48.76,75.77 X1.5
  Top 1.778: X2.5 21.23,78.8 28.5,78.8 | 28.5,78.8 38.5,78.8 | 38.5,78.8 45.8,78.8 48.6,76 X1.5 | X2.3 28.5,78.8 | X2.1 38.5,78.8
  Bottom 1.27: D2.C 48.38,71.25 50.9,72.87
  Bottom 1.778: Q3.D 53.9,69.59 50.9,72.87 48.6,75.17 X1.5
N$17
  Bottom 0.61: R16.1 72.8,69.8 74.5,71 PWR.A
N$23
  Bottom 1.778: F1.P$2 F1.P$1 62,71.63 58.6,75.43 X1.3
N$32
  Bottom 0.61: C14.2 JP1.1
N$37
  Bottom 0.406: IC3.12 44.58,44.45 Q1.2 46.99,40.77 C2.1
N$38
  Bottom 0.406: IC3.13 44.58,46.99 Q1.1 46.62,48.53 C1.1
N$47
  Bottom 0.61: C9.1 IC3.32
PW1A
  Top 0.406: IC3.4 25.4,24.13 24.13,25.4 15.24,25.4 11.43,21.59 8.89,21.59 A.8
PW1B
  Top 0.406: IC3.5 34.29,26.67 29.21,31.75 29.21,33.66 33.02,37.47 | 33.02,37.47 32.95,37.47 | 33.02,37.47 33.02,56.52 34.92,58.42 39.37,58.42 41.67,59.83 56.09,59.83 R12.2
  Top 0.61: Q2.1 65.3,67.8 63.9,66.4 58.9,66.4 58.9,62.56 58.25,61.91 R12.2
PW2B  (via drill 0.6)
  Top 0.406: v27.3,59.69 IC3.18
  Bottom 0.406: v27.3,59.69 25.4,58.42 20.32,58.42 16.51,62.23 8.89,62.23 C.8
PW3A
  Top 0.406: IC3.21 20.58,64.77 R13.1
PW3B  (via drill 0.6)
  Top 0.406: v29.84,54.61 26.67,50.8 17.78,50.8 12.7,46.35 12.7,43.18 8.89,43.18 B.8 | v29.84,62.83 29.88,63.5 31.11,64.77 IC3.20
  Bottom 0.406: v29.84,54.61 v29.84,62.83
RX
  Bottom 0.406: IC3.14 42.03,49.53 43.7,51.2 70.2,51.2 72.8,48.6 75.11,48.6 COM.3
SCK
  Top 0.406: ISP.3 64.77,9.43 46.99,9.43 46.99,16.51 50.8,20.32 IC2.9
  Bottom 0.406: IC2.9 50.8,20.32 46.99,26.67 41.91,26.67 41.91,31.75 39.37,34.29 IC3.8
SCL
  Bottom 0.406: IC3.22 20.77,62.23 18,65 14.5,65 14,65.5 14,67.29 EXP.4
SDA
  Top 0.406: IC3.23 20.81,59.69 16.5,64 16.5,67.33 EXP.3
T0
  Top 0.61: C4.+ 25.4,15.24 22.86,15.24 22.26,15.84 IC3.40 20.32,16.51 R3.2
  Bottom 0.61: T0.2 25.4,9.12 C4.+
T1
  Top 0.813: IC3.39 17.78,19.05 R2.2 16.51,15.24 19.05,12.7 C3.+
  Bottom 0.61: T1.2 20.32,8.49 20.32,9.56 C3.+
T2
  Top 0.813: R4.2 16.51,21.59 IC3.38
  Bottom 0.813: R4.2 13.97,12.7 12.7,11.43 T2.2 C5.+
TX
  Bottom 0.406: IC3.15 41.63,52.07 43.57,52.28 72.75,52.28 COM.2
V+
  Top 1.27: 1C5.1 47.74,66.25 50.3,68.9 54.7,68.9 56.4,67.9 56.5,66.92 Q3.S
  Bottom 0.813: 1C5.1 45.92,68.08 C15.+
  Bottom 1.27: R7.2 57.94,63.03 58.2,63.3
  Bottom 1.778: F1.P$4 F1.P$3 61,60.5 58.2,63.3 57.7,63.8 57.7,64.31 Q3.S
VCC
  Bottom 0.61: IC3.10 C8.1
  pour Bottom (isolate 0.406): 0,80 80,80 80,0 0,0
XD  (via drill 0.6)
  Top 0.406: v17.91,29.34 20.32,31.75 IC3.34
  Bottom 0.406: A.3 8.89,17.78 8.89,21.59 11.43,21.59 v17.91,29.34
XES
  Top 0.406: IC3.1 33.66,13.3 33.66,9.53 34.29,7.89 XS.2
XS
  Bottom 0.406: A.5 21.59,29.21 IC3.35
YD
  Bottom 0.406: A.4 8.89,13.97 12.7,13.97 12.7,19.05 20.32,26.67 IC3.36
YES
  Top 0.406: IC3.2 39.37,17.18 39.37,12.7 43.18,7.89 YS.2
YS
  Top 0.406: A.6 8.26,17.78 9.53,19.05 11.43,19.05 16.51,24.13 IC3.37
ZD
  Top 0.406: IC3.28 16.51,46.99 15.24,45.72 15.24,39.37 11.43,35.56 8.89,35.56 B.4
ZES
  Bottom 0.406: IC3.3 39.37,19.72 39.37,12.7 41.91,10.16 50.8,10.16 ZS.2
ZS
  Bottom 0.406: B.6 9.53,40.64 11.43,40.64 13.97,43.18 13.97,44.45 15.24,45.72 20.99,45.72 IC3.29

### Text on the board
Document: D2 | RST | J1 | C14 | C1 | C18 | C6 | COM | 5V | 0V | C8 | D1 | C12 | C2 | 3v3 | C13
Reference: Q4 | Fan | VM | VM | VM | VS | HB | Pwr | C15 | C20 | C11 | Q2 | F1 | IC5 | Q3 | R16 | #53050 | R13 | R7 | F1 | E1/E2 | R20 | R15 | IC1 | R5 | R6 | R12 | HB | C19 | (C) Alan Wood 2011 | L1 | IC4 | C17 | Q1 | Z/E | C7 | R17 | IC3 | R1 | C9 | C10 | R8 | Folknology | SDCARD | Labs | 07/06/12 | C16 | IC2 | X/Y | SDWP | R4 | R2 | R3 | C3 | C4 | OMC-V1.2 | ISP | C5 | T2 | T1 | T0 | XS | YS | ZS